# EAGLE schematic esp_mod1 (EAGLE 7.2.0)
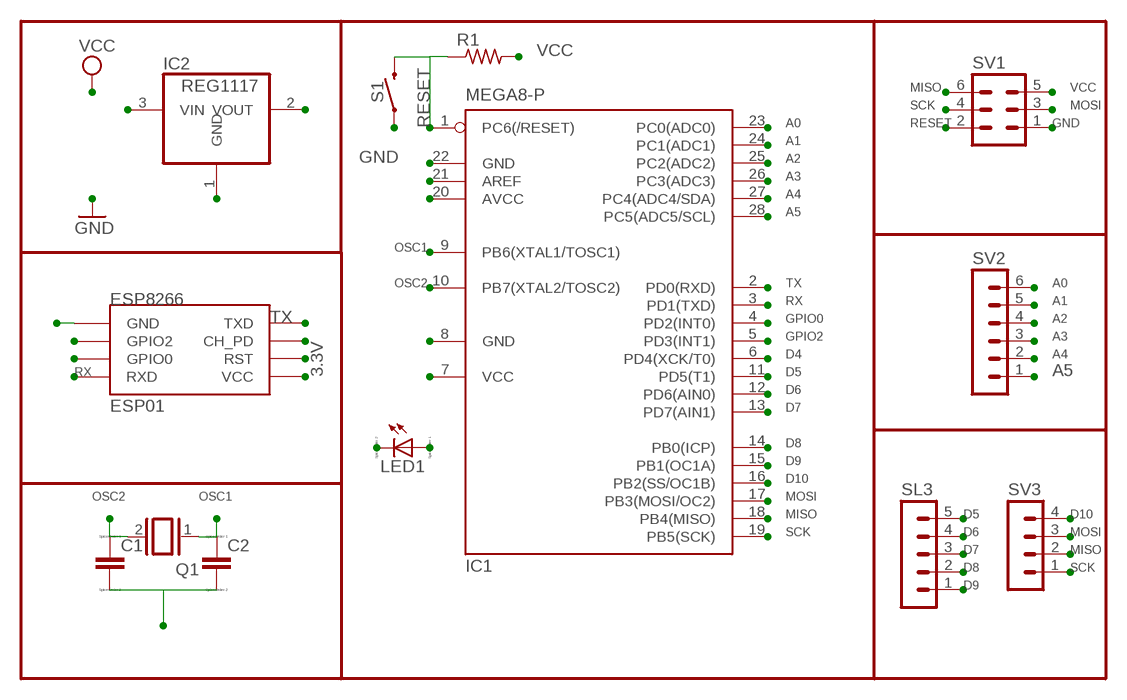
[diagram p0: schematic, sheet 1]

## Parts
C1  CC1206  [C1206]
C2  CC1206  [C1206]
ESP8266  ESP01  [ESP01]
IC1  MEGA8-P  [DIL28-3]
IC2  REG1117  [SOT223]
LED1  LED_E  [LED_1206]
Q1  XTAL  [Q]
R1  R-US_M1206  [M1206]
S1  MOMENTARY-SWITCH-SPST-PTH-6.0MM  [TACTILE_SWITCH_PTH_6.0MM]
SL3  MA05-1  [MA05-1]
SV1  MA03-2  [MA03-2]
SV2  MA06-1  [MA06-1]
SV3  MA04-1  [MA04-1]

## Nets
3.3V: ESP8266.CH_PD ESP8266.RST ESP8266.VCC IC2.2(VOUT)
A0: IC1.23(PC0(ADC0)) SV2.6
A1: IC1.24(PC1(ADC1)) SV2.5
A2: IC1.25(PC2(ADC2)) SV2.4
A3: IC1.26(PC3(ADC3)) SV2.3
A4: IC1.27(PC4(ADC4/SDA)) SV2.2
A5: IC1.28(PC5(ADC5/SCL)) SV2.1
D4: IC1.6(PD4(XCK/T0)) LED1.A
D5: IC1.11(PD5(T1)) SL3.5
D6: IC1.12(PD6(AIN0)) SL3.4
D7: IC1.13(PD7(AIN1)) SL3.3
D8: IC1.14(PB0(ICP)) SL3.2
D9: IC1.15(PB1(OC1A)) SL3.1
D10: IC1.16(PB2(SS/OC1B)) SV3.4
GND: C1.2 C2.2 ESP8266.GND IC1.8(GND) IC1.22(GND) IC2.1(GND) LED1.C S1.1 SV1.1
GPIO0: ESP8266.GPIO0 IC1.4(PD2(INT0))
GPIO2: ESP8266.GPIO2 IC1.5(PD3(INT1))
MISO: IC1.18(PB4(MISO)) SV1.6 SV3.2
MOSI: IC1.17(PB3(MOSI/OC2)) SV1.3 SV3.3
N$22: IC1.21(AREF)
OSC1: C2.1 IC1.9(PB6(XTAL1/TOSC1)) Q1.1
OSC2: C1.1 IC1.10(PB7(XTAL2/TOSC2)) Q1.2
RESET: IC1.1(PC6(/RESET)) R1.1 S1.3 SV1.2
RX: ESP8266.RX(RXD) IC1.3(PD1(TXD))
SCK: IC1.19(PB5(SCK)) SV1.4 SV3.1
TX: ESP8266.TX(TXD) IC1.2(PD0(RXD))
VCC: IC1.7(VCC) IC1.20(AVCC) IC2.3(VIN) R1.2 SV1.5

## Library data of the parts
C1 C2 = eagle-ltspice:C: CAPACITOR, European symbol; SPICEMODEL: NONE; SPICEPREFIX: C
ESP8266 = esp8266modules:ESP01: ESP8266 Wifi module 01
IC1 = atmel:MEGA8-P: MICROCONTROLLER 8 Kbytes FLASH, 1 kbytes SRAM, 512 bytes EEPROM, USART, 4-channel 10 bit ADC, 2-channel 8 bit ADC Pin compatible with Atmega48, ATMega88, ATMega168 Source: avr.lbr; OC_FARNELL: unknown; OC_NEWARK: unknown
IC2 = burr-brown:REG1117: 800mA and 1A Low Dropout (LDO) Positive Regulator 1.8V, 2.5V, 2.85V, 3.3V, 5V, and Adj; MPN: REG1117; OC_FARNELL: 1097566; OC_NEWARK: 14P6981
LED1 = eagle-ltspice:LED_E: LED Source: http://www.osram.convergy.de Source: www.luxeon.com Source: www.kingbright.com; SPICEMODEL: NONE; SPICEPREFIX: D; SPICETYPE: diode
Q1 = special:XTAL: CRYSTAL
R1 = resistor:R-US_: RESISTOR, American symbol
S1 = SparkFun-Switches:MOMENTARY-SWITCH-SPST: Momentary Switch (Pushbutton) - SPST Normally-open (NO) SPST momentary switches (buttons, pushbuttons). Variants PTH-12MM - 12mm square, through-hole Momentary Pushbutton Switch - 12mm Square <https://www.sparkfun.com/products/9190> (COM-09190) PTH-6.0MM, PTH-6.0MM-KIT - 6.0mm square, through-hole Mini Pushbutton Switch <https://www.sparkfun.com/products/97> (COM-00097) KIT package intended for soldering kit's - only one side of pads' copper is exposed. PTH-RIGHT-ANGLE-KIT - Right-angle, through-hole Right Angle Tactile Button <https://www.sparkfun.com/products/10791> - Used on SparkFun BigTime Watch Kit <https://www.sparkfun.com/products/11734> SMD-12MM - 12mm square, surface-mount Tactile Button - SMD (12mm) <https://www.sparkfun.com/products/12993> (COM-12993) Used on SparkFun PicoBoard <https://www.sparkfun.com/products/11888> SMD-4.5MM - 4.5mm Square Trackball Switch Used on SparkFun Blackberry Trackballer Breakout <https://www.sparkfun.com/products/13169> SMD-4.6MMX2.8MM - 4.60mm x 2.80mm, surface mount Used on SparkFun SAMD21 Mini Breakout <https://www.sparkfun.com/products/13664> SMD-5.2MM, SMD-5.2-REDUNDANT - 5.2mm square, surface-mount Mini Pushbutton Switch - SMD <https://www.sparkfun.com/products/8720> (COM-08720) Used on Arduino Pro Mini <https://www.sparkfun.com/products/11114> REDUNDANT package connects both switch circuits together SMD-6.0X3.5MM - 6.0 x 3.5mm, surface mount Momentary Reset Switch SMD <https://www.sparkfun.com/products/8229> (COM-08229) SMD-6.2MM-TALL - 6.2mm square, surface mount Tactile Button - SMD (6mm) <https://www.sparkfun.com/products/12992> Used on SparkFun Digital Sandbox <https://www.sparkfun.com/products/12651> SMD-RIGHT-ANGLE - Right-angle, surface mount Used on SparkFun Block for Intel® Edison - Arduino <https://www.sparkfun.com/products/13036>; PROD_ID: SWCH-08441; SF_SKU: COM-00097
SL3 = con-lstb:MA05-1: PIN HEADER; OC_FARNELL: unknown; OC_NEWARK: unknown
SV1 = con-lstb:MA03-2: PIN HEADER; OC_FARNELL: unknown; OC_NEWARK: unknown
SV2 = con-lstb:MA06-1: PIN HEADER; OC_FARNELL: unknown; OC_NEWARK: unknown
SV3 = con-lstb:MA04-1: PIN HEADER; OC_FARNELL: unknown; OC_NEWARK: unknown